# EAGLE design 18-de-77 (EAGLE 6.6.0)
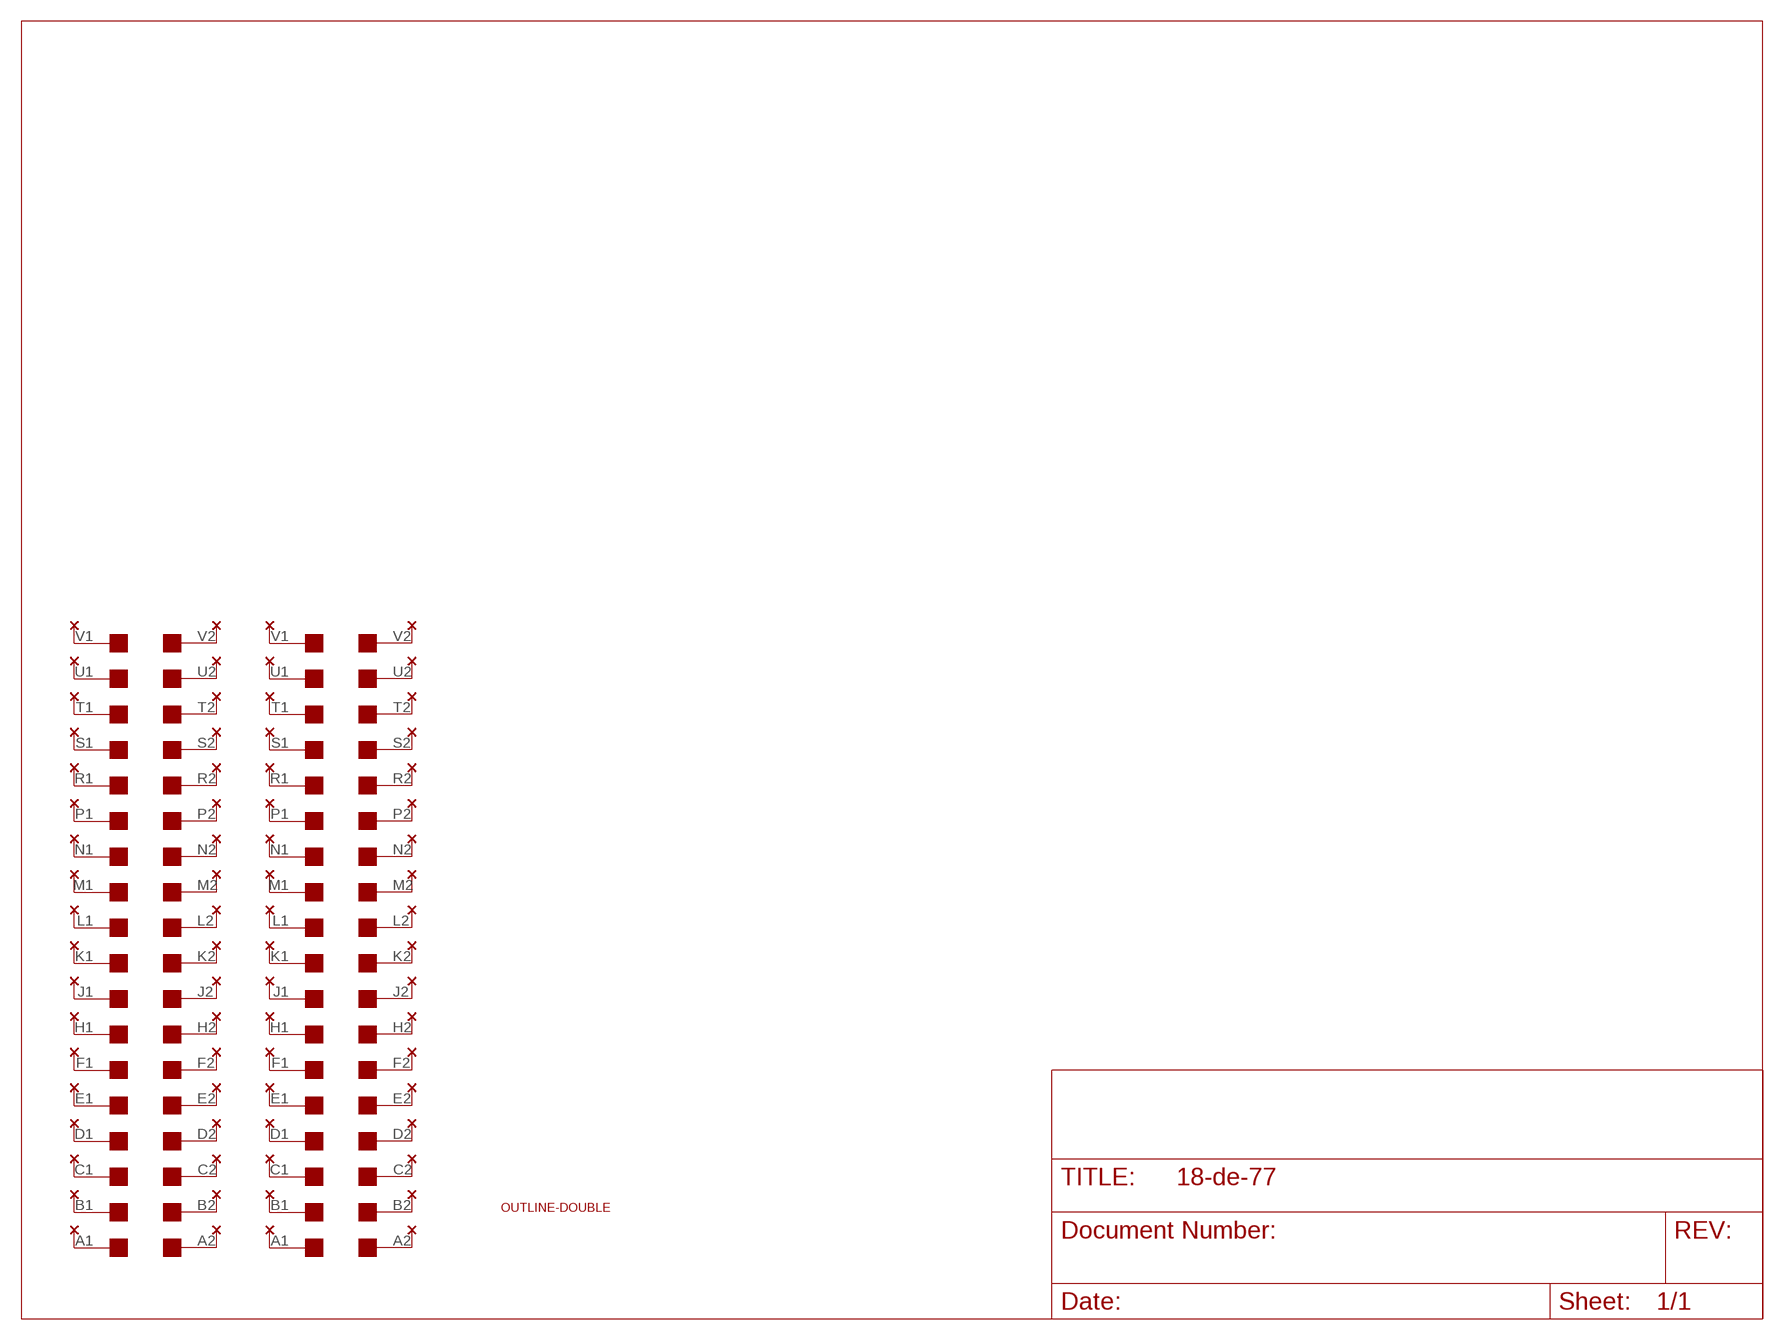
[diagram p0: schematic, sheet 1]

## Parts
U$1  SINGLE  [EDGE-CON2]
U$2  THRU-HOLE2A  [THRU-HOLEA]
U$3  THRU-HOLE2A  [THRU-HOLEA]
U$4  OUTLINE-DOUBLE  [DOUBLE]
U$6  SINGLE  [EDGE-CON2]

## Nets
N$1: U$1.K2 U$2.K2
N$2: U$1.J2 U$2.J2
N$3: U$1.H2 U$2.H2
N$4: U$1.L2 U$2.L2
N$5: U$1.M2 U$2.M2
N$6: U$1.N2 U$2.N2
N$7: U$1.P2 U$2.P2
N$8: U$1.F2 U$2.F2
N$9: U$1.E2 U$2.E2
N$10: U$1.D2 U$2.D2
N$11: U$1.C2 U$2.C2
N$12: U$1.R2 U$2.R2
N$13: U$1.S2 U$2.S2
N$14: U$1.B2 U$2.B2
N$15: U$1.A2 U$2.A2
N$16: U$1.T2 U$2.T2
N$17: U$1.U2 U$2.U2
N$18: U$1.V2 U$2.V2
N$19: U$1.A1 U$2.A1
N$20: U$1.V1 U$2.V1
N$21: U$1.U1 U$2.U1
N$22: U$1.T1 U$2.T1
N$23: U$1.S1 U$2.S1
N$24: U$1.R1 U$2.R1
N$25: U$1.P1 U$2.P1
N$26: U$1.N1 U$2.N1
N$27: U$1.M1 U$2.M1
N$28: U$1.L1 U$2.L1
N$29: U$1.K1 U$2.K1
N$30: U$1.J1 U$2.J1
N$31: U$1.H1 U$2.H1
N$32: U$1.F1 U$2.F1
N$33: U$1.E1 U$2.E1
N$34: U$1.D1 U$2.D1
N$35: U$1.C1 U$2.C1
N$36: U$1.B1 U$2.B1
N$37: U$3.K2 U$6.K2
N$38: U$3.J2 U$6.J2
N$39: U$3.H2 U$6.H2
N$40: U$3.L2 U$6.L2
N$41: U$3.M2 U$6.M2
N$42: U$3.N2 U$6.N2
N$43: U$3.P2 U$6.P2
N$44: U$3.F2 U$6.F2
N$45: U$3.E2 U$6.E2
N$46: U$3.D2 U$6.D2
N$47: U$3.C2 U$6.C2
N$48: U$3.R2 U$6.R2
N$49: U$3.S2 U$6.S2
N$50: U$3.B2 U$6.B2
N$51: U$3.A2 U$6.A2
N$52: U$3.T2 U$6.T2
N$53: U$3.U2 U$6.U2
N$54: U$3.V2 U$6.V2
N$55: U$3.A1 U$6.A1
N$56: U$3.V1 U$6.V1
N$57: U$3.U1 U$6.U1
N$58: U$3.T1 U$6.T1
N$59: U$3.S1 U$6.S1
N$60: U$3.R1 U$6.R1
N$61: U$3.P1 U$6.P1
N$62: U$3.N1 U$6.N1
N$63: U$3.M1 U$6.M1
N$64: U$3.L1 U$6.L1
N$65: U$3.K1 U$6.K1
N$66: U$3.J1 U$6.J1
N$67: U$3.H1 U$6.H1
N$68: U$3.F1 U$6.F1
N$69: U$3.E1 U$6.E1
N$70: U$3.D1 U$6.D1
N$71: U$3.C1 U$6.C1
N$72: U$3.B1 U$6.B1

## Library data of the parts
U$1 U$6 = dec-con:SINGLE: Single-Height DEC board
U$2 U$3 = dec-con:THRU-HOLE2: Thru-Hole addition to double-sided edge connector.
U$4 = dec-con:OUTLINE-*: Board outlines for DEC boards.

## Net classes
0 default: width 0.635 mm

## Board
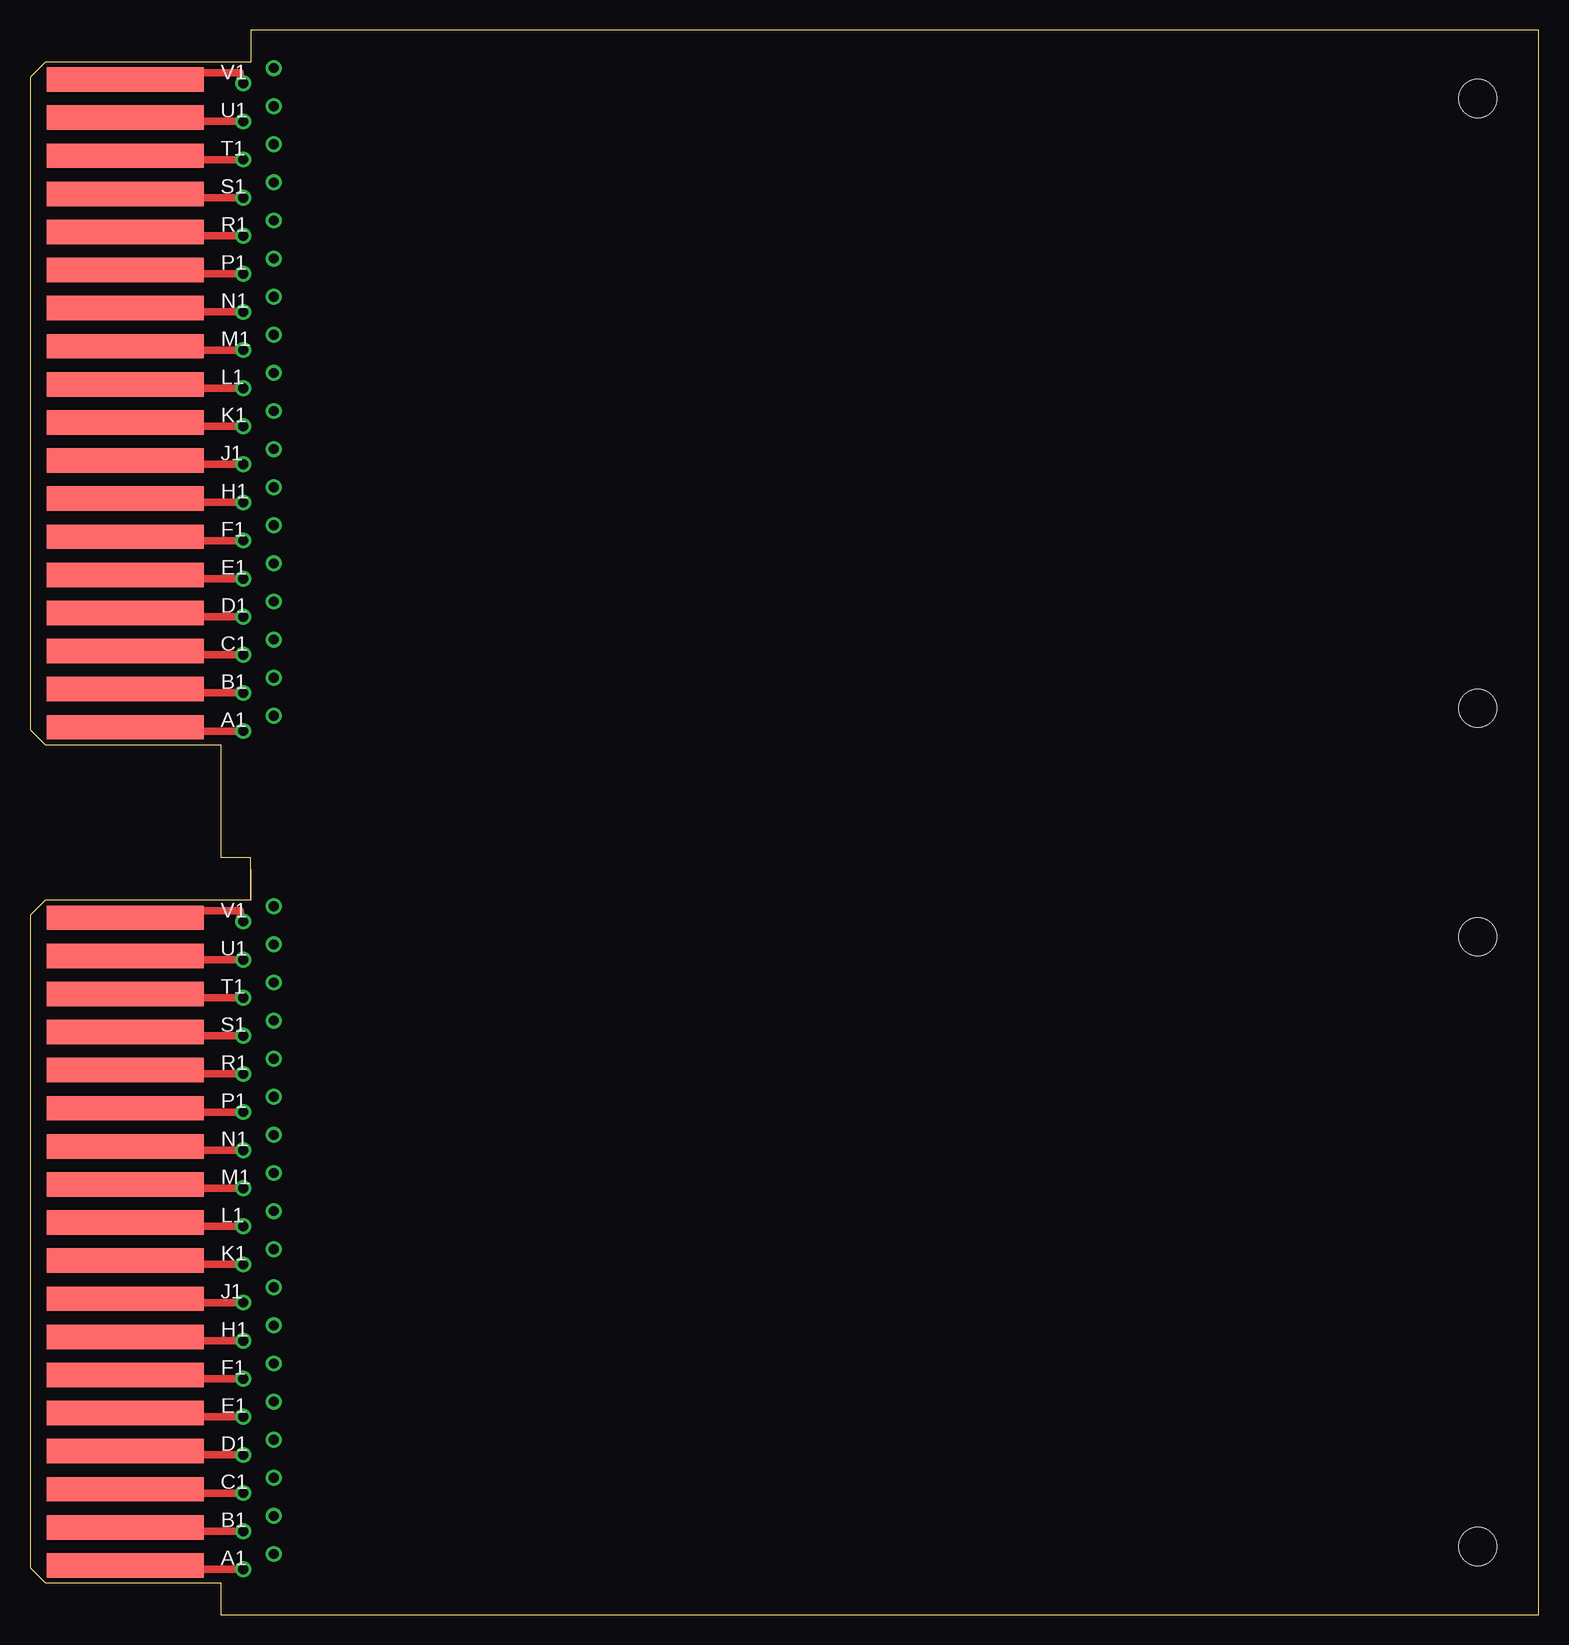
[diagram p1: board, top side]
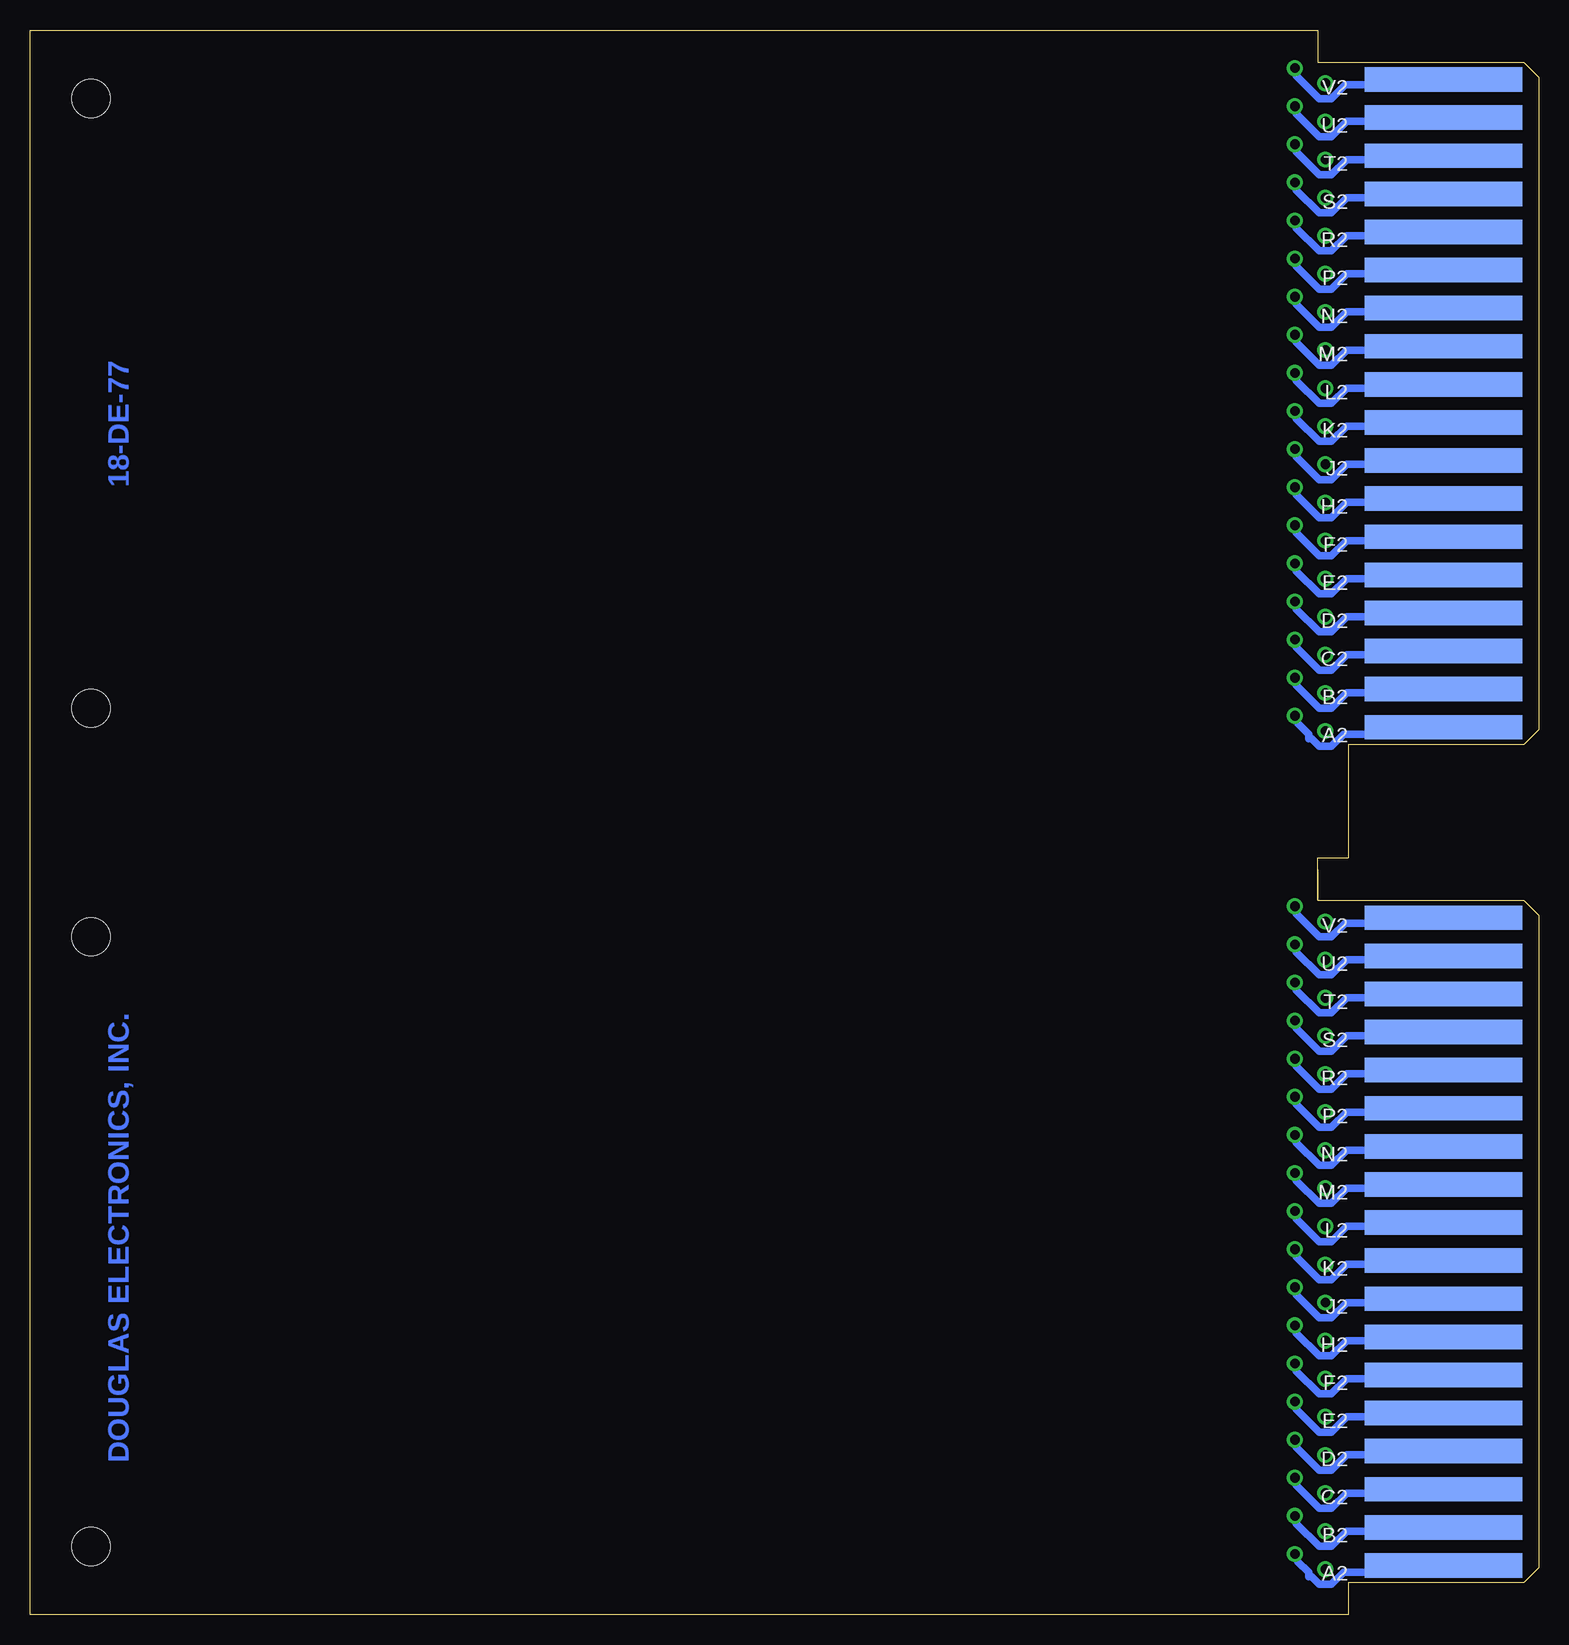
[diagram p2: board, bottom side, seen from below]

Size 125.73 x 132.08 mm. Coordinates in mm from the lower left corner, seen from the top.
Copper layers (1+16): Top 0.035mm / dielectric 1.5mm / Bottom 0.035mm
Design rules "16mils": minimum track width 16mil, minimum drill 32mil, track to track 15mil, track to pad 10mil, pad to pad 10mil, via to via 10mil, smd to smd 10mil, copper to edge 13mil, drill to drill 10mil, minimum pad ring 10mil, minimum via ring 8mil, stop-mask expansion 0mil, vias tented up to drill 0mil, thermal gap 10mil

### Footprints (pad centres in the part's own frame; a part is rotated, then mirrored left to right if it is on the bottom)
EDGE-CON2 = smd 13.106 x 2.032: A1 7.938,4.128; B1 7.938,7.303; C1 7.938,10.477; D1 7.938,13.652; E1 7.938,16.828; F1 7.938,20.003; H1 7.938,23.177; J1 7.938,26.352; K1 7.938,29.527; L1 7.938,32.703; M1 7.938,35.877; N1 7.938,39.053; P1 7.938,42.227; R1 7.938,45.403; S1 7.938,48.578; T1 7.938,51.752; U1 7.938,54.928; V1 7.938,58.102 | smd 13.106 x 2.032 bottom: A2 7.938,4.128; B2 7.938,7.303; C2 7.938,10.477; D2 7.938,13.652; E2 7.938,16.828; F2 7.938,20.003; H2 7.938,23.177; J2 7.938,26.352; K2 7.938,29.527; L2 7.938,32.703; M2 7.938,35.877; N2 7.938,39.053; P2 7.938,42.227; R2 7.938,45.403; S2 7.938,48.578; T2 7.938,51.752; U2 7.938,54.928; V2 7.938,58.102
THRU-HOLEA = drill 0.813 pad 1.27: A1 17.78,3.81; A2 20.32,5.08; B1 17.78,6.985; B2 20.32,8.255; C1 17.78,10.16; C2 20.32,11.43; D1 17.78,13.335; D2 20.32,14.605; E1 17.78,16.51; E2 20.32,17.78; F1 17.78,19.685; F2 20.32,20.955; H1 17.78,22.86; H2 20.32,24.13; J1 17.78,26.035; J2 20.32,27.305; K1 17.78,29.21; K2 20.32,30.48; L1 17.78,32.385; L2 20.32,33.655; M1 17.78,35.56; M2 20.32,36.83; N1 17.78,38.735; N2 20.32,40.005; P1 17.78,41.91; P2 20.32,43.18; R1 17.78,45.085; R2 20.32,46.355; S1 17.78,48.26; S2 20.32,49.53; T1 17.78,51.435; T2 20.32,52.705; U1 17.78,54.61; U2 20.32,55.88; V1 17.78,57.785; V2 20.32,59.055
DOUBLE = hole 3.175: 120.65,56.515; 120.65,5.715; 120.65,75.565; 120.65,126.365

### Placement (x,y rotation side)
U$1  0,69.85 0 top
U$2  0,69.85 0 top
U$3  0,0 0 top
U$4  0,0 0 top
U$6  0,0 0 top

### Tracks (layer width: path | path; a pad name or v marks a point on that pad's centre or on a via)
N$1
  Bottom 0.635: U$1.K2 13.46,99.06 16,99.06 17.27,97.79 18.29,97.79 20.19,99.69 U$2.K2
N$2
  Bottom 0.635: U$1.J2 13.46,95.89 16,95.89 17.27,94.61 18.29,94.61 20.19,96.52 U$2.J2
N$3
  Bottom 0.635: U$1.H2 13.46,92.71 16,92.71 17.27,91.44 18.29,91.44 20.19,93.34 U$2.H2
N$4
  Bottom 0.635: U$1.L2 13.46,102.23 16,102.23 17.27,100.97 18.29,100.97 20.19,102.87 U$2.L2
N$5
  Bottom 0.635: U$1.M2 13.46,105.41 16,105.41 17.27,104.14 18.29,104.14 20.19,106.05 U$2.M2
N$6
  Bottom 0.635: U$1.N2 13.46,108.58 16,108.58 17.27,107.31 18.29,107.31 20.19,109.22 U$2.N2
N$7
  Bottom 0.635: U$1.P2 13.46,111.76 16,111.76 17.27,110.49 18.29,110.49 20.19,112.39 U$2.P2
N$8
  Bottom 0.635: U$1.F2 13.46,89.53 16,89.53 17.27,88.27 18.29,88.27 20.19,90.17 U$2.F2
N$9
  Bottom 0.635: U$1.E2 13.46,86.36 16,86.36 17.27,85.09 18.29,85.09 20.19,87 U$2.E2
N$10
  Bottom 0.635: U$1.D2 13.46,83.19 16,83.19 17.27,81.92 18.29,81.92 20.19,83.82 U$2.D2
N$11
  Bottom 0.635: U$1.C2 13.46,80.01 16,80.01 17.27,78.74 18.29,78.74 20.19,80.64 U$2.C2
N$12
  Bottom 0.635: U$1.R2 13.46,114.94 16,114.94 17.27,113.67 18.29,113.67 20.19,115.57 U$2.R2
N$13
  Bottom 0.635: U$1.S2 13.46,118.11 16,118.11 17.27,116.84 18.29,116.84 20.19,118.75 U$2.S2
N$14
  Bottom 0.635: U$1.B2 13.46,76.83 16,76.83 17.27,75.56 18.29,75.56 20.19,77.47 U$2.B2
N$15
  Bottom 0.635: U$2.A2 20.07,74.3 19.18,73.41 19.18,73.03 18.92,73.03 18.29,72.39 17.27,72.39 16.26,73.41 14.1,73.41 U$1.A2
N$16
  Bottom 0.635: U$1.T2 13.46,121.28 16,121.28 17.27,120.02 18.29,120.02 20.19,121.92 U$2.T2
N$17
  Bottom 0.635: U$1.U2 13.46,124.46 16,124.46 17.27,123.19 18.29,123.19 20.19,125.09 U$2.U2
N$18
  Bottom 0.635: U$1.V2 13.46,127.51 16.13,127.51 17.27,126.36 18.29,126.36 20.19,128.27 U$2.V2
N$19
  Top 0.635: U$2.A1 14.1,73.66 U$1.A1
N$20
  Top 0.635: U$2.V1 17.53,128.27 17.53,128.52 14.1,128.52 U$1.V1
N$21
  Top 0.635: U$2.U1 14.1,124.46 U$1.U1
N$22
  Top 0.635: U$2.T1 14.1,121.28 U$1.T1
N$23
  Top 0.635: U$2.S1 14.1,118.11 U$1.S1
N$24
  Top 0.635: U$2.R1 14.1,114.94 U$1.R1
N$25
  Top 0.635: U$2.P1 14.1,111.76 U$1.P1
N$26
  Top 0.635: U$2.N1 14.1,108.58 U$1.N1
N$27
  Top 0.635: U$2.M1 14.1,105.41 U$1.M1
N$28
  Top 0.635: U$2.L1 14.1,102.23 U$1.L1
N$29
  Top 0.635: U$2.K1 14.1,99.06 U$1.K1
N$30
  Top 0.635: U$2.J1 14.1,95.89 U$1.J1
N$31
  Top 0.635: U$2.H1 14.1,92.71 U$1.H1
N$32
  Top 0.635: U$2.F1 14.1,89.53 U$1.F1
N$33
  Top 0.635: U$2.E1 14.1,86.36 U$1.E1
N$34
  Top 0.635: U$2.D1 14.1,83.19 U$1.D1
N$35
  Top 0.635: U$2.C1 14.1,80.01 U$1.C1
N$36
  Top 0.635: U$2.B1 14.1,76.83 U$1.B1
N$37
  Bottom 0.635: U$6.K2 13.46,29.21 16,29.21 17.27,27.94 18.29,27.94 20.19,29.84 U$3.K2
N$38
  Bottom 0.635: U$6.J2 13.46,26.04 16,26.04 17.27,24.77 18.29,24.77 20.19,26.67 U$3.J2
N$39
  Bottom 0.635: U$6.H2 13.46,22.86 16,22.86 17.27,21.59 18.29,21.59 20.19,23.5 U$3.H2
N$40
  Bottom 0.635: U$6.L2 13.46,32.38 16,32.38 17.27,31.11 18.29,31.11 20.19,33.02 U$3.L2
N$41
  Bottom 0.635: U$6.M2 13.46,35.56 16,35.56 17.27,34.29 18.29,34.29 20.19,36.2 U$3.M2
N$42
  Bottom 0.635: U$6.N2 13.46,38.73 16,38.73 17.27,37.47 18.29,37.47 20.19,39.37 U$3.N2
N$43
  Bottom 0.635: U$6.P2 13.46,41.91 16,41.91 17.27,40.64 18.29,40.64 20.19,42.55 U$3.P2
N$44
  Bottom 0.635: U$6.F2 13.46,19.68 16,19.68 17.27,18.41 18.29,18.41 20.19,20.32 U$3.F2
N$45
  Bottom 0.635: U$6.E2 13.46,16.51 16,16.51 17.27,15.24 18.29,15.24 20.19,17.14 U$3.E2
N$46
  Bottom 0.635: U$6.D2 13.46,13.34 16,13.34 17.27,12.06 18.29,12.06 20.19,13.97 U$3.D2
N$47
  Bottom 0.635: U$6.C2 13.46,10.16 16,10.16 17.27,8.89 18.29,8.89 20.19,10.79 U$3.C2
N$48
  Bottom 0.635: U$6.R2 13.46,45.09 16,45.09 17.27,43.81 18.29,43.81 20.19,45.72 U$3.R2
N$49
  Bottom 0.635: U$6.S2 13.46,48.26 16,48.26 17.27,46.99 18.29,46.99 20.19,48.9 U$3.S2
N$50
  Bottom 0.635: U$6.B2 13.46,6.99 16,6.99 17.27,5.71 18.29,5.71 20.19,7.62 U$3.B2
N$51
  Bottom 0.635: U$3.A2 20.07,4.45 19.18,3.56 19.18,3.17 18.92,3.17 18.29,2.54 17.27,2.54 16.26,3.56 14.1,3.56 U$6.A2
N$52
  Bottom 0.635: U$6.T2 13.46,51.44 16,51.44 17.27,50.16 18.29,50.16 20.19,52.07 U$3.T2
N$53
  Bottom 0.635: U$6.U2 13.46,54.61 16,54.61 17.27,53.34 18.29,53.34 20.19,55.24 U$3.U2
N$54
  Bottom 0.635: U$6.V2 13.46,57.66 16.13,57.66 17.27,56.52 18.29,56.52 20.19,58.42 U$3.V2
N$55
  Top 0.635: U$3.A1 14.1,3.81 U$6.A1
N$56
  Top 0.635: U$3.V1 17.53,58.42 17.53,58.67 14.1,58.67 U$6.V1
N$57
  Top 0.635: U$3.U1 14.1,54.61 U$6.U1
N$58
  Top 0.635: U$3.T1 14.1,51.44 U$6.T1
N$59
  Top 0.635: U$3.S1 14.1,48.26 U$6.S1
N$60
  Top 0.635: U$3.R1 14.1,45.09 U$6.R1
N$61
  Top 0.635: U$3.P1 14.1,41.91 U$6.P1
N$62
  Top 0.635: U$3.N1 14.1,38.73 U$6.N1
N$63
  Top 0.635: U$3.M1 14.1,35.56 U$6.M1
N$64
  Top 0.635: U$3.L1 14.1,32.38 U$6.L1
N$65
  Top 0.635: U$3.K1 14.1,29.21 U$6.K1
N$66
  Top 0.635: U$3.J1 14.1,26.04 U$6.J1
N$67
  Top 0.635: U$3.H1 14.1,22.86 U$6.H1
N$68
  Top 0.635: U$3.F1 14.1,19.68 U$6.F1
N$69
  Top 0.635: U$3.E1 14.1,16.51 U$6.E1
N$70
  Top 0.635: U$3.D1 14.1,13.34 U$6.D1
N$71
  Top 0.635: U$3.C1 14.1,10.16 U$6.C1
N$72
  Top 0.635: U$3.B1 14.1,6.99 U$6.B1

### Text on the board
Bottom: 18-DE-77 | DOUGLAS ELECTRONICS, INC.